# Altium schematic sheet OpenMPPT2-Supply.SchDoc: =Project + Document
size A4; SheetNumber: 2; SheetTotal: 7; Document: Supply
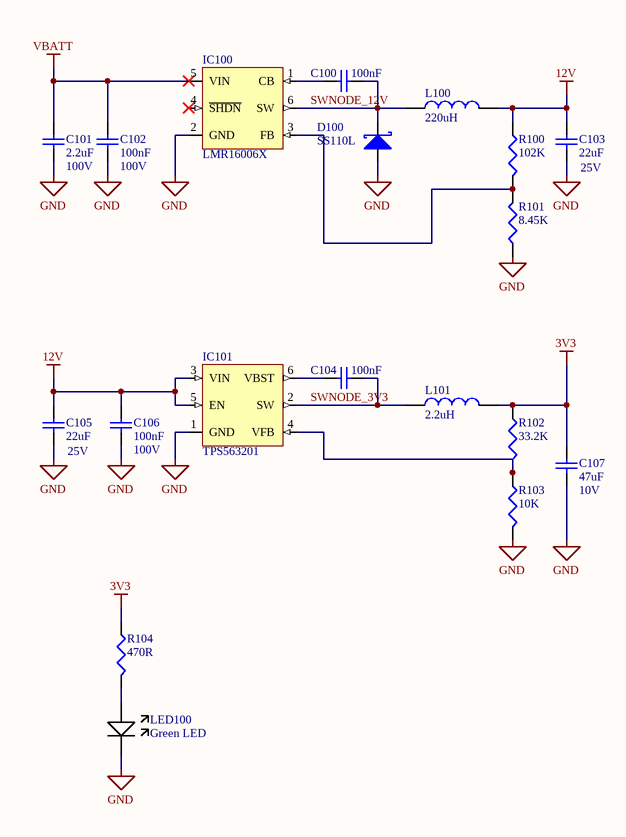
[diagram p0: OpenMPPT2-Supply.SchDoc]

## Parts
C100  100nF  [C-0805]
C101  2.2uF  Voltage Rating: 100V  [C-1210]
C102  100nF  Voltage Rating: 100V  [C-0805]
C103  22uF  Voltage Range: 25V  [C-1206]
C104  100nF  [C-0805]
C105  22uF  Voltage Range: 25V  [C-1206]
C106  100nF  Voltage Rating: 100V  [C-0805]
C107  47uF  Voltage Rating: 10V  [C-1210]
D100  SS110L  [SUB-SMA]
IC100  LMR16006X  [SOT-23-6]
IC101  TPS563201  [SOT-23-6]
L100  value 220uH  [WE-PD_1050_Metal Base]  (hidden comment: WE-PD, 7447714221)
L101  value 2.2uH  [WE-PD_7332_Metal Base]  (hidden comment: WE-PD, 744778002)
LED100  Green LED  [0603]
R100  102K  [0603]
R101  8.45K  [0603]
R102  33.2K  [0603]
R103  10K  [0603]
R104  470R  [0603]

## Nets
3V3: C107.1 L101.2 R102.1 R104.1
12V: C103.1 C105.1 C106.2 IC101.3(VIN) IC101.5(EN) L100.2 R100.1
GND: C101.1 C102.1 C103.2 C105.2 C106.1 C107.2 D100.1(A) IC100.2(GND) IC101.1(GND) LED100.K R101.1 R103.2
VBATT: C101.2 C102.2 IC100.5(VIN)
SWNODE_3V3: C104.2 IC101.2(SW) L101.1
SWNODE_12V: C100.2 D100.2(K) IC100.6(SW) L100.1
NetC100_1: C100.1 IC100.1(CB)
NetC104_1: C104.1 IC101.6(VBST)
NetIC100_3: IC100.3(FB) R100.2 R101.2
NetIC101_4: IC101.4(VFB) R102.2 R103.1
NetLED100_A: LED100.A R104.2

Not connected (* = marked no-connect by the designer): IC100 4(~{SHDN})*

## Notes on the sheet
- Title
- Size:
- Date:
- A4
- Designer:
- Time:
- Revision:
- Sheet
- of
- File:

## Library data of the parts
C100 C102 C104 C106 = 100nF/0805/CER/100V: Capacitor, 100nF, 100V, X7R; Capacitance Tolerance: ± 10%; Capacitor Case Style: 0805; Brand Number: C0805C104K1RACTU; Brand: KEMET; Dielectric Characteristic: X7R; Capacitance: 100nF; Temperature Range: -55°C to +125°C; Price: 0,096; Order Code Supplier: 1650862; Supplier: Farnell
  C100 C104: Voltage Rating: 100V
C101 = 2.2uF/1210/CER/100V: Capacitor, 2.2uF, 100V, X7R; Capacitance Tolerance: ± 20%; Capacitor Case Style: 1210; Brand Number: C1210C225M1RACTU; Brand: KEMET; Dielectric Characteristic: X7R; Capacitance: 2.2uF; Temperature Range: -55°C to +125°C; Price: 0,64; Order Code Supplier: 1838747; Supplier: Farnell
C103 C105 = 22uF/1206/CER/25V: Capacitor, 22uF, 25V, ±10%, X5R, C1206, T:-55°C to +85°C; Brand: Murata; Brand Number: GRM31CR61E226KE15L; Capacitor Case Style: 1206; Order Code Supplier: 1797010; Price: 0,64; Dielectric Characteristic: X5R; Capacitance: 22uF; Capacitance Tolerance: ± 10%; Supplier: Farnell; Temperature Range: -55°C to +85°C
C107 = 47uF/1210/CER/10V: Capacitor, 47uF, 10V, X7R; Capacitance Tolerance: ± 10%; Capacitor Case Style: 1210; Brand Number: GRM32ER71A476KE15L; Brand: MURATA; Dielectric Characteristic: X7R; Capacitance: 47uF; Temperature Range: -55°C to +125°C; Price: 1,85; Order Code Supplier: 1797018; Supplier: Farnell
D100 = SS110L: Diode Schottky, Vrrm: 100V, If: 1A, Vf: 0.9V; Brand: TAIWAN SEMICONDUCTOR; Case Style: SMF; Brand Number: SS110L; Forward Current: 1A; Forward Voltage: 0.9V; Order Code Supplier: 1559156; Price: 0,191; Supplier: Farnell; Temperature Range: -55°C to +150°C; Vrrm: 100V
IC100 = LMR16006X: 60V, 600mA Step-Down Regulator; Brand: Texas Instruments; Case Style: TSOT-6; Brand Number: LMR16006X; Order Code Supplier: 2455133; Price: 3,37; Supplier: Farnell; Temperature Range: -55°C to +155°C
IC101 = TPS563201: 17V Input, 3-A Synchronous Step-Down Voltage Regulator; Brand: Texas Instruments; Case Style: TSOT; Brand Number: TPS563201; Order Code Supplier: 2522588; Price: 1,44; Supplier: Farnell; Temperature Range: -55°C to +155°C
L100 = WE-PD, 7447714221: WE-PD SMD Shielded Power Inductor, size 1050, 220uH; Base: Metal Base; PublishedDate: Sep. 2016; Publisher: Wurth Elektronik; ComponentLink1Description: Manufacturer; ComponentLink1URL: http://www.we-online.de; ComponentLink2Description: Datasheet; ComponentLink2URL: http://katalog.we-online.com/pbs/datasheet/7447714221.pdf; PartNumber: 7447714221; Size: 1050
L101 = WE-PD, 744778002: WE-PD SMD Shielded Power Inductor, size 7332, 2.2uH; Base: Metal Base; PublishedDate: Sep. 2016; Publisher: Wurth Elektronik; ComponentLink1Description: Manufacturer; ComponentLink1URL: http://www.we-online.de; ComponentLink2Description: Datasheet; ComponentLink2URL: http://katalog.we-online.com/pbs/datasheet/744778002.pdf; PartNumber: 744778002; Size: 7332
LED100 = KPT-1608SGC: LED, Green, 0603; Brand: Kingbright; Forward Voltage: 2.2V; Forward Current: 20mA; Order Code Supplier: 2099223; Supplier: Farnell; Price: 0,057; Brand Number: KPT-1608SGC
R100 = 102K/0603/0100W/75V: Resistor, 102K, 1%, 0.063W, 50V, 100PPM, 0603; Brand: Vishay; Brand Number: CRCW0603102KFKEA.; Power Rating: 0.100W; Voltage Rating: 75V; Case Style: 0603; Order Code Supplier: 2138497; Price: 0,0402; Resistance: 102K; Supplier: Farnell; Temperature Coefficient: ± 100PPM; Temperature Range: -55°C to +125°C
R101 = 8.45K/0603/0100W/75V: Resistor, 8.45K, 1%, 0.1W, 75V, 100PPM, 0603; Brand: Vishay; Brand Number: CRCW06038K45FKEA.; Case Style: 0603; Order Code Supplier: 2138418; Power Rating: 0.1W; Price: 0,0419; Resistance: 8.45K; Supplier: Farnell; Temperature Coefficient: ± 100PPM; Temperature Range: -55°C to +155°C; Voltage Rating: 75V
R102 = 33.2K/0603/0063W/50V: Resistor, 33.2K, 1%, 0.063W, 50V, 100PPM, 0603; Brand: MULTICOMP; Brand Number: MC 0.063W 0603 1% 33K2; Case Style: 0603; Order Code Supplier: 1170939; Power Rating: 0.063W; Price: 0,038; Resistance: 33.2K; Supplier: Farnell; Temperature Coefficient: ± 100PPM; Temperature Range: -55°C to +125°C; Voltage Rating: 50V
R103 = 10K/0603/0063W/50V: Resistor, 10K, 1%, 0.063W, 50V, 100PPM, 0603; Brand: MULTICOMP; Brand Number: MC0063W0603110K; Case Style: 0603; Order Code Supplier: 2130939; Power Rating: 0.063W; Price: 0,038; Resistance: 10K; Supplier: Farnell; Temperature Coefficient: ± 100PPM; Temperature Range: -55°C to +125°C; Voltage Rating: 50V
R104 = 470/0603/0125W/50V: Resistor, 470R, 1%, 0.125W, 50V, 100PPM, 0603; Brand: MULTICOMP; Brand Number: MCHP03W8F4700T5E; Case Style: 0603; Order Code Supplier: 1576273; Power Rating: 0.125W; Price: 0,08; Resistance: 470R; Supplier: Farnell; Temperature Coefficient: ± 100PPM; Temperature Range: -55°C to +155°C; Voltage Rating: 50V